# EAGLE design Callisto_v1p01 (EAGLE 9.6.2)
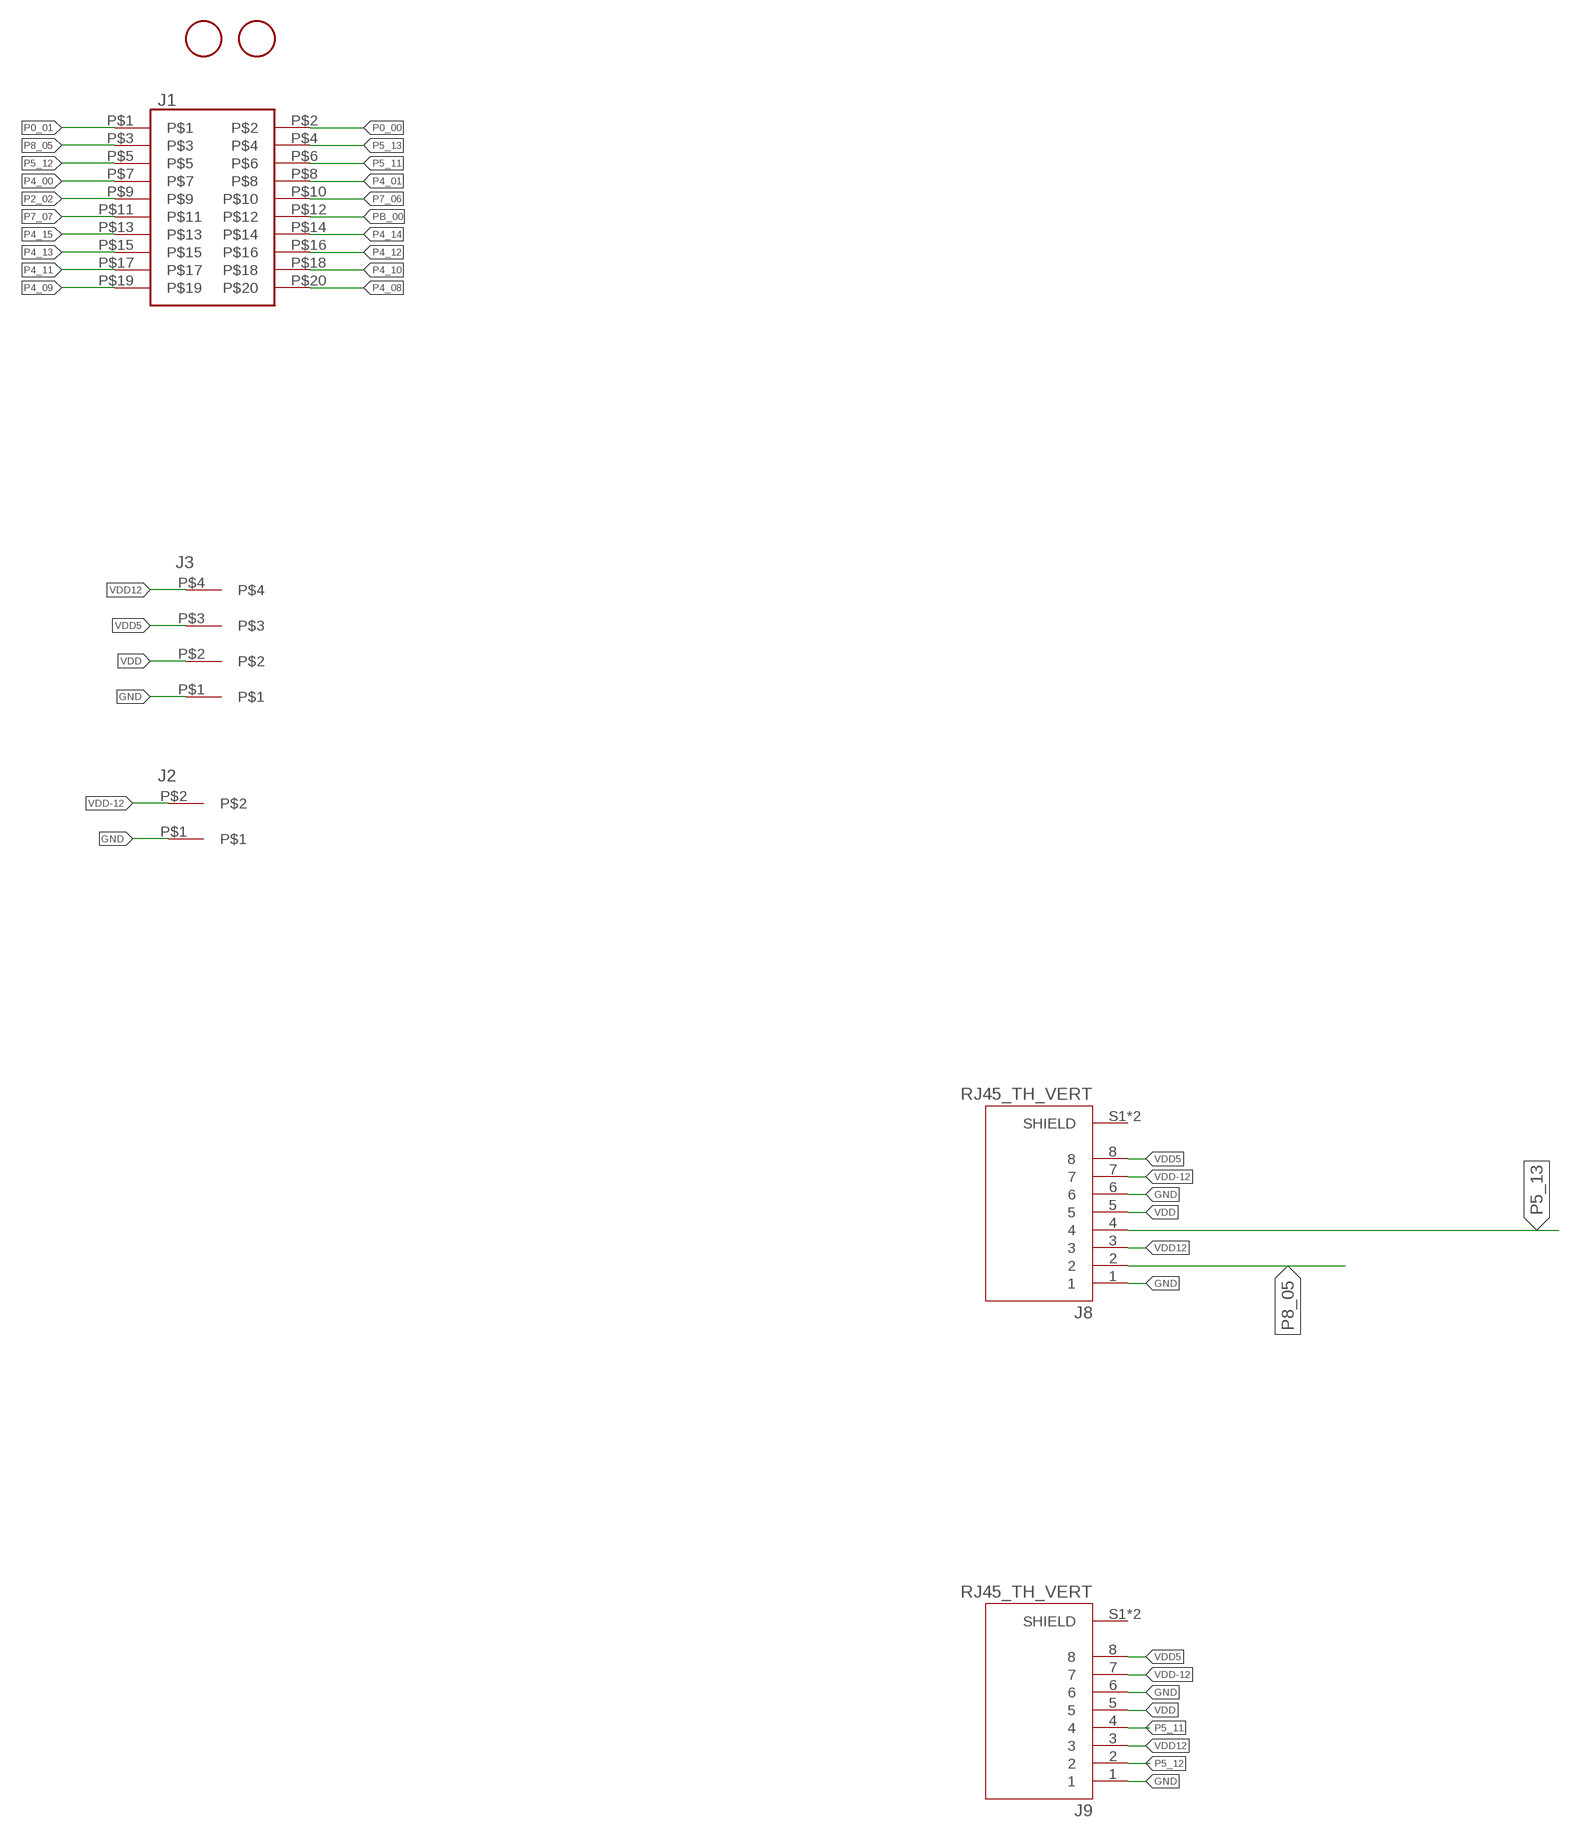
[diagram p0: schematic, sheet 1, part 1 of 2]
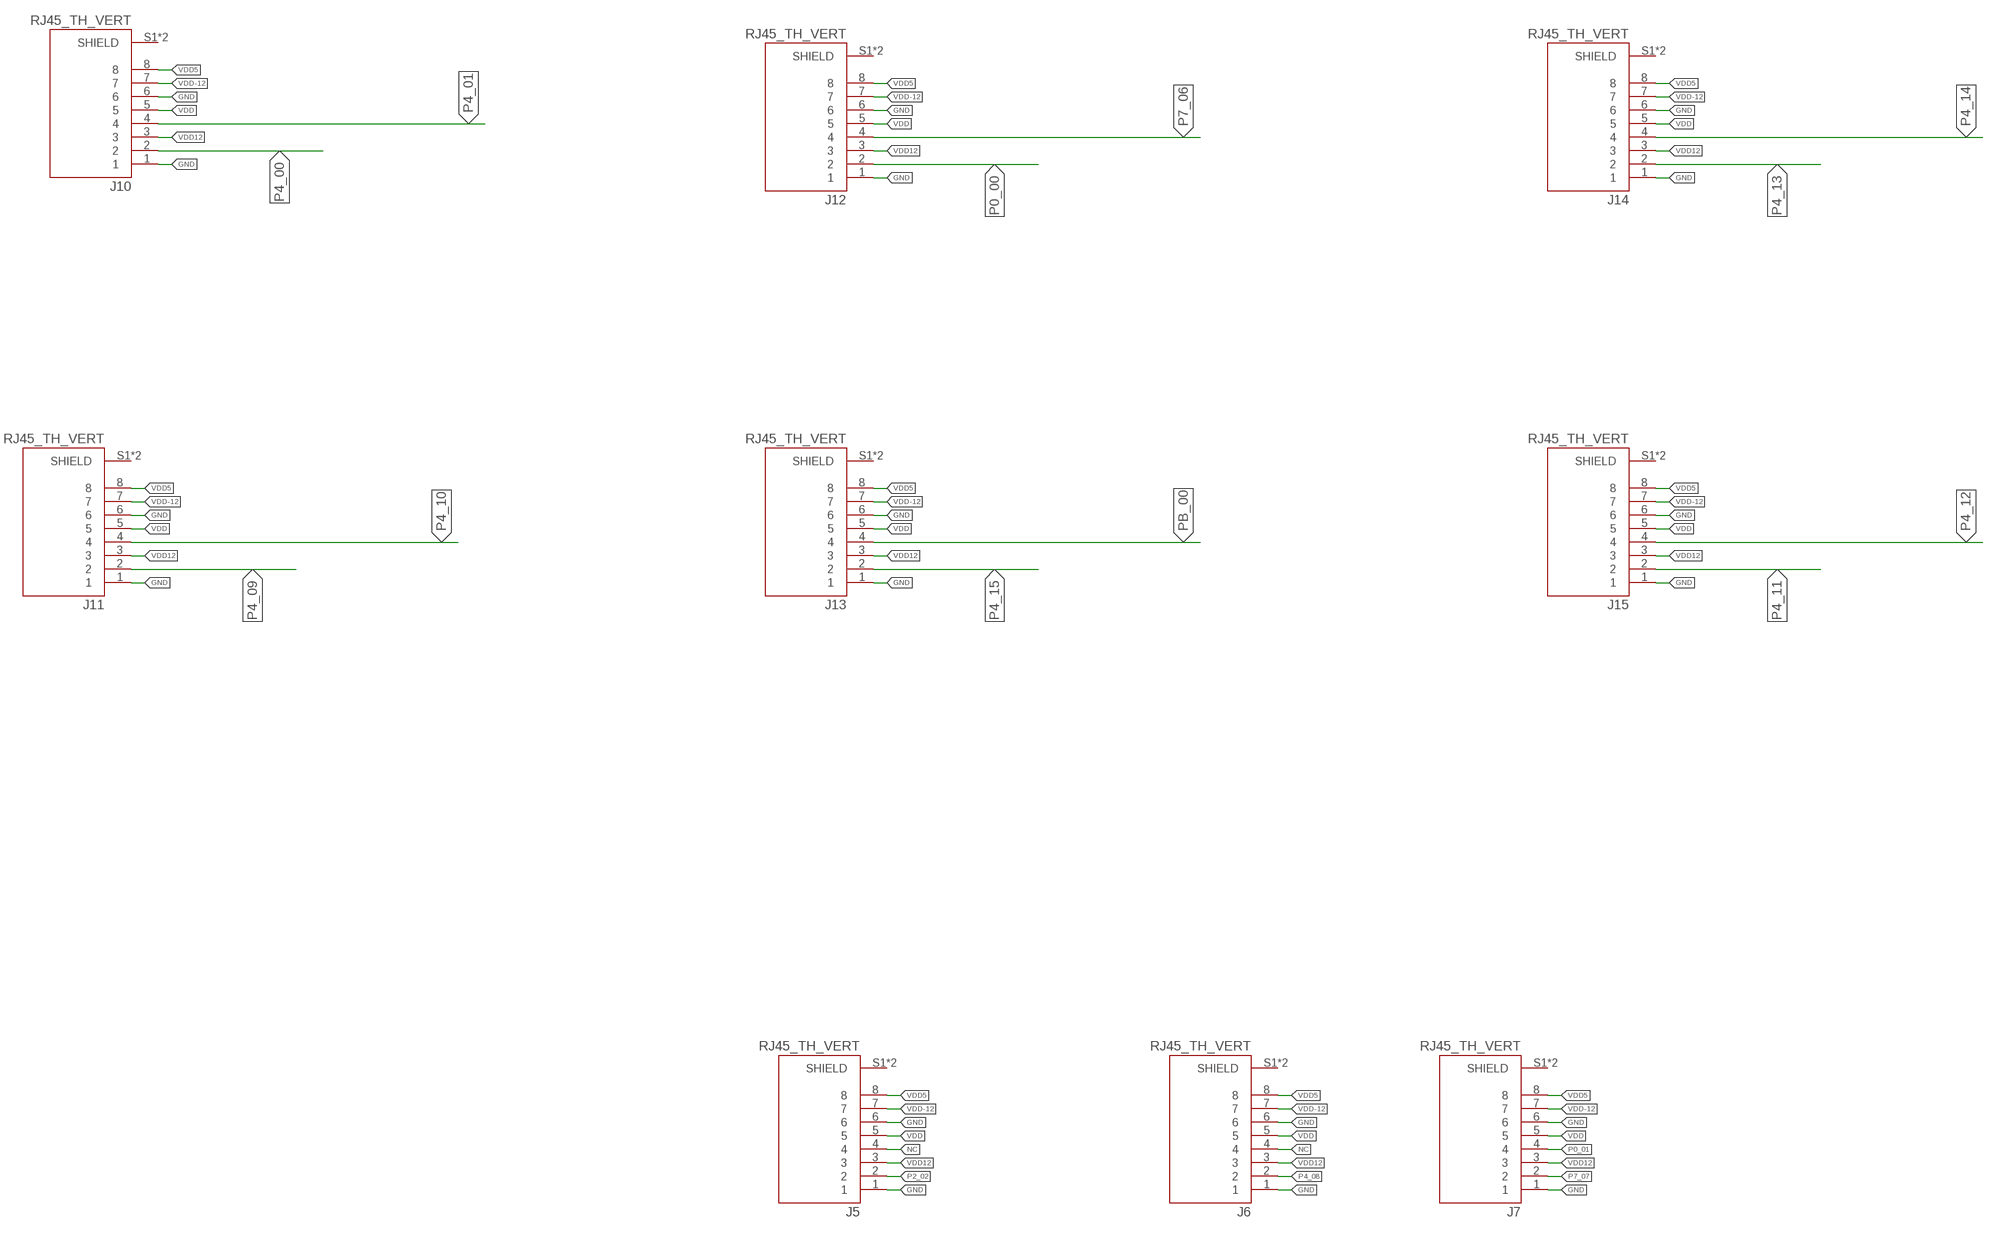
[diagram p1: schematic, sheet 1, part 2 of 2]

## Parts
J1  20-pos  2_X_10_HEADER_GENERIC  [2_X_10_.1_INCH]
J2  2-pos  3.81MM_1_X_2_RT_ANGLE_PLUG_HEADER  [2_3.81MM_PITCH]
J3  4-pos  3.81MM_1_X_4_RT_ANGLE_PLUG_HEADER  [1X4_3.81MM_PITCH]
J5  RJ45_TH_VERT  [ASSMANN_A-2014-2S-4-N-R]
J6  RJ45_TH_VERT  [ASSMANN_A-2014-2S-4-N-R]
J7  RJ45_TH_VERT  [ASSMANN_A-2014-2S-4-N-R]
J8  RJ45_TH_VERT  [ASSMANN_A-2014-2S-4-N-R]
J9  RJ45_TH_VERT  [ASSMANN_A-2014-2S-4-N-R]
J10  RJ45_TH_VERT  [ASSMANN_A-2014-2S-4-N-R]
J11  RJ45_TH_VERT  [ASSMANN_A-2014-2S-4-N-R]
J12  RJ45_TH_VERT  [ASSMANN_A-2014-2S-4-N-R]
J13  RJ45_TH_VERT  [ASSMANN_A-2014-2S-4-N-R]
J14  RJ45_TH_VERT  [ASSMANN_A-2014-2S-4-N-R]
J15  RJ45_TH_VERT  [ASSMANN_A-2014-2S-4-N-R]
U$1  FIDUCIAL_1MM  [FIDUCIAL_1MM]
U$2  FIDUCIAL_1MM  [FIDUCIAL_1MM]

## Nets
GND: J2.P$1 J3.P$1 J5.1 J5.6 J6.1 J6.6 J7.1 J7.6 J8.1 J8.6 J9.1 J9.6 J10.1 J10.6 J11.1 J11.6 J12.1 J12.6 J13.1 J13.6 J14.1 J14.6 J15.1 J15.6
NC: J5.4 J6.4
P0_00: J1.P$2 J12.2
P0_01: J1.P$1 J7.4
P2_02: J1.P$9 J5.2
P4_00: J1.P$7 J10.2
P4_01: J1.P$8 J10.4
P4_08: J1.P$20 J6.2
P4_09: J1.P$19 J11.2
P4_10: J1.P$18 J11.4
P4_11: J1.P$17 J15.2
P4_12: J1.P$16 J15.4
P4_13: J1.P$15 J14.2
P4_14: J1.P$14 J14.4
P4_15: J1.P$13 J13.2
P5_11: J1.P$6 J9.4
P5_12: J1.P$5 J9.2
P5_13: J1.P$4 J8.4
P7_06: J1.P$10 J12.4
P7_07: J1.P$11 J7.2
P8_05: J1.P$3 J8.2
PB_00: J1.P$12 J13.4
VDD: J3.P$2 J5.5 J6.5 J7.5 J8.5 J9.5 J10.5 J11.5 J12.5 J13.5 J14.5 J15.5
VDD5: J3.P$3 J5.8 J6.8 J7.8 J8.8 J9.8 J10.8 J11.8 J12.8 J13.8 J14.8 J15.8
VDD12: J3.P$4 J5.3 J6.3 J7.3 J8.3 J9.3 J10.3 J11.3 J12.3 J13.3 J14.3 J15.3
VDD-12: J2.P$2 J5.7 J6.7 J7.7 J8.7 J9.7 J10.7 J11.7 J12.7 J13.7 J14.7 J15.7
Unconnected: J5.S1(SHIELD) J5.S2(SHIELD) J6.S1(SHIELD) J6.S2(SHIELD) J7.S1(SHIELD) J7.S2(SHIELD) J8.S1(SHIELD) J8.S2(SHIELD) J9.S1(SHIELD) J9.S2(SHIELD) J10.S1(SHIELD) J10.S2(SHIELD) J11.S1(SHIELD) J11.S2(SHIELD) J12.S1(SHIELD) J12.S2(SHIELD) J13.S1(SHIELD) J13.S2(SHIELD) J14.S1(SHIELD) J14.S2(SHIELD) J15.S1(SHIELD) J15.S2(SHIELD)

## Library data of the parts
J1 = 3D_MIG_Controller:2_X_10_HEADER_GENERIC: CONN HEADER R/A 20POS 2.54MM, Straight, Right Angle; PARTNO: 67996-420HLF
J2 = 3D_MIG_Controller:3.81MM_1_X_2_RT_ANGLE_PLUG_HEADER: TERM BLOCK HDR 2POS 90DEG 3.81MM; PARTNO: 691322310002
J3 = 3D_MIG_Controller:3.81MM_1_X_4_RT_ANGLE_PLUG_HEADER: 4 Position Terminal Block Header, Male Pins, Shrouded (4 Side) 0.150" (3.81mm) 90°, Right Angle - Through Hole; PARTNO: 691322310004
J5-J15 = 3D_MIG_Controller:RJ45_TH_VERT: Jack Modular Connector 8p8c (RJ45, Ethernet) Vertical Shielded; DESCRIPTION: Jack Modular Connector 8p8c (RJ45, Ethernet) Vertical Shielded; DIGI-KEY_PART_NUMBER: AE10399-ND; MF: Assmann WSW Components; MP: A-2014-2S-4-N-R; PACKAGE: None
U$1 U$2 = 3D_MIG_Controller:FIDUCIAL_1MM: For use by pick and place machines to calibrate the vision/machine, 1mm By microbuilder.eu

## Board
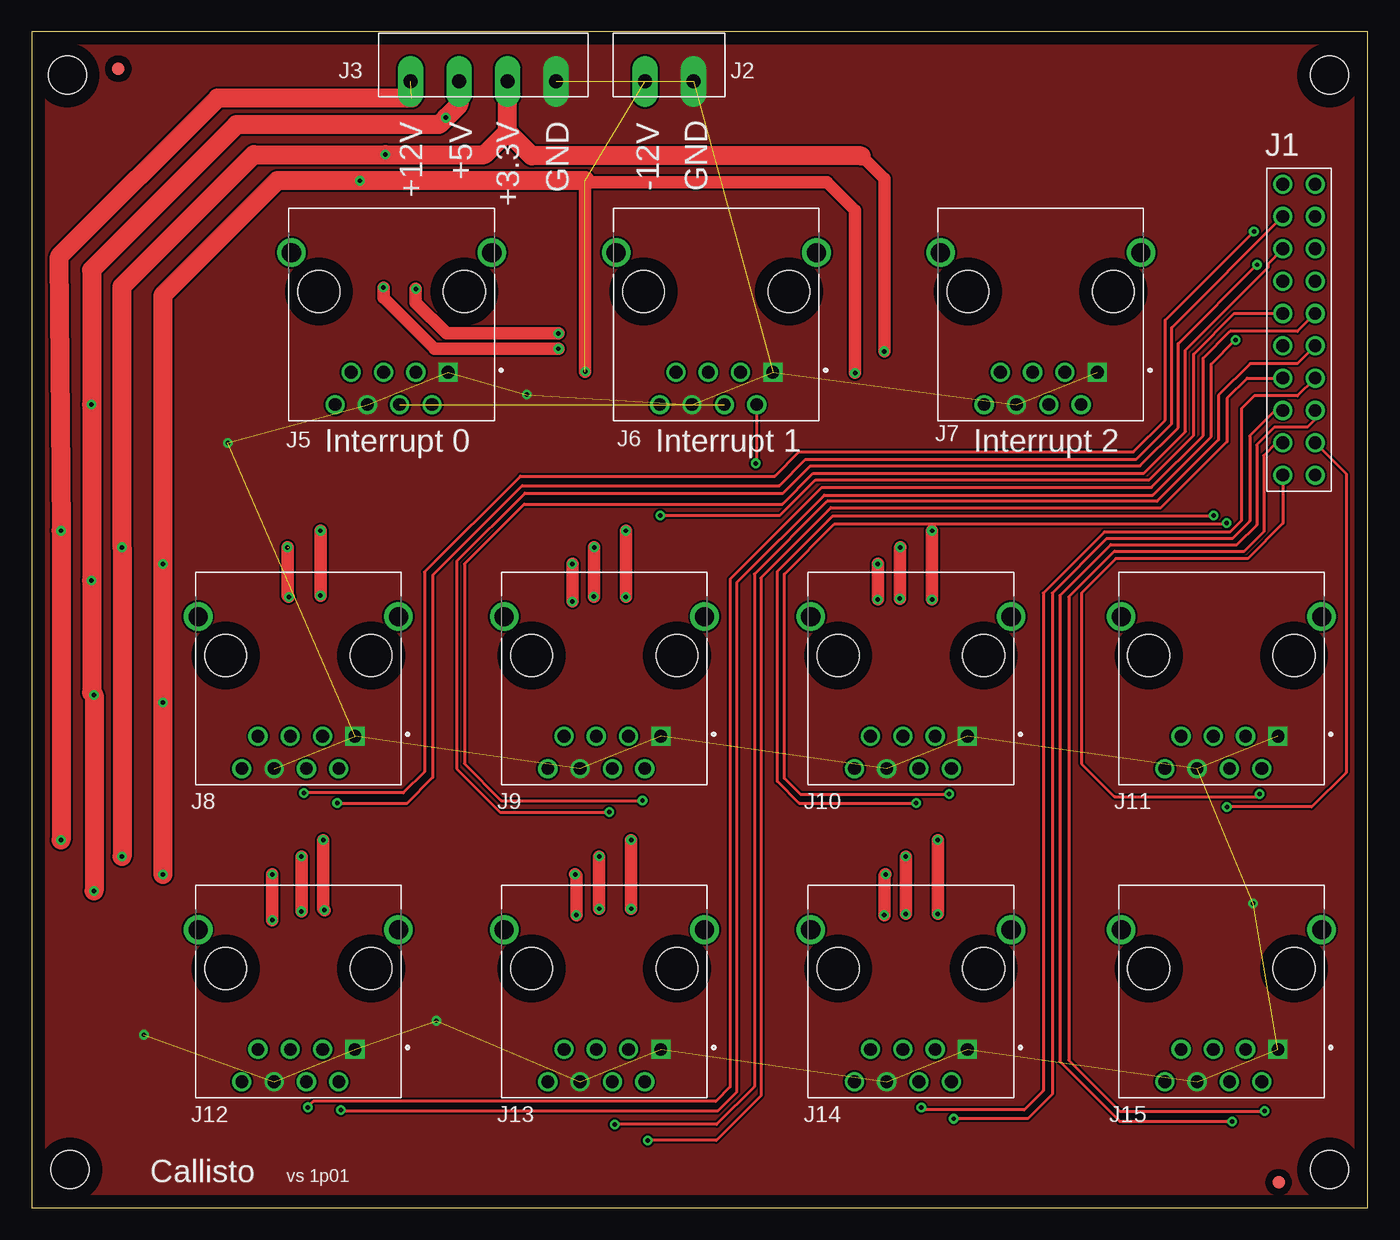
[diagram p2: board, top side]
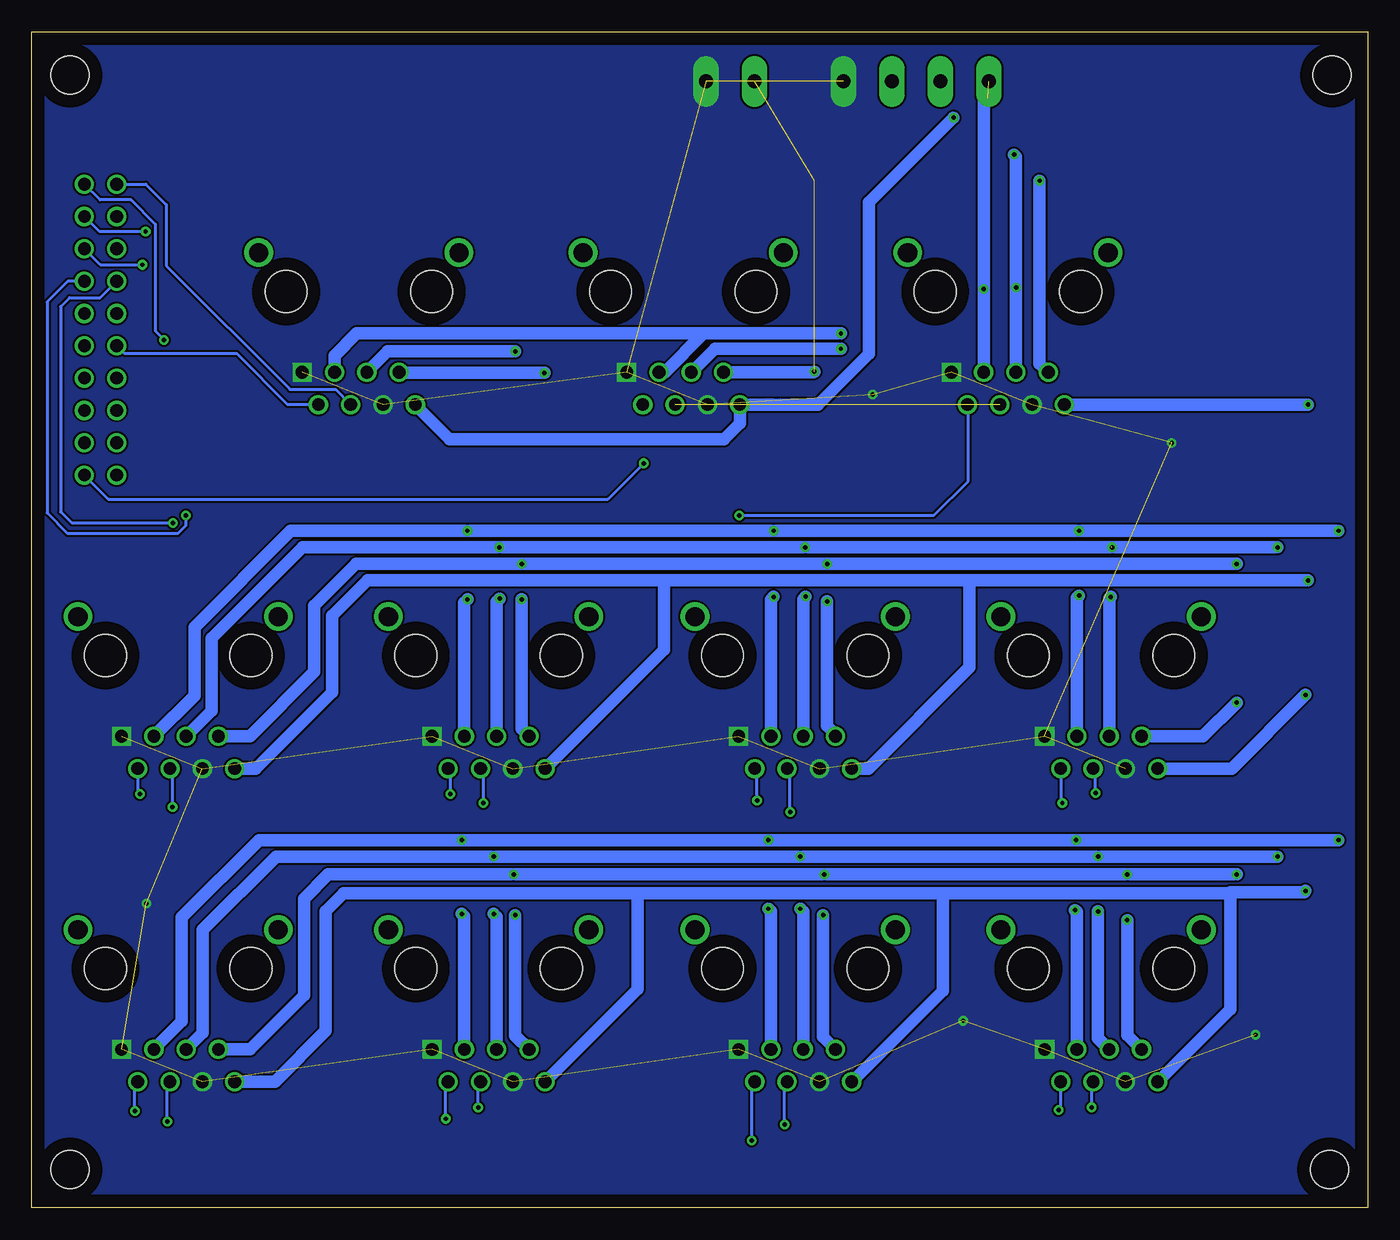
[diagram p3: board, bottom side, seen from below]

Size 105 x 92.4 mm. Coordinates in mm from the lower left corner, seen from the top.
Outline: 0,0 105,0 105,92.4 0,92.4 0,0
Copper layers (1*16): Top 0.035mm / dielectric 1.5mm / Bottom 0.035mm
Design rules "default": minimum track width 6mil, minimum drill 0.35mm, track to track 6mil, track to pad 6mil, pad to pad 6mil, via to via 6mil, smd to smd 6mil, copper to edge 40mil, drill to drill 6mil, minimum pad ring 10mil, minimum via ring 8mil, stop-mask expansion 4mil, vias tented up to drill 0mil, thermal gap 10mil
Holes 3 mm at 102,89 2.8,89 102,3 3,3

### Footprints (pad centres in the part's own frame; a part is rotated, then mirrored left to right if it is on the bottom)
2_X_10_.1_INCH = drill 1: P$1 -11.43,-1.27; P$2 -11.43,1.27; P$3 -8.89,-1.27; P$4 -8.89,1.27; P$5 -6.35,-1.27; P$6 -6.35,1.27; P$7 -3.81,-1.27; P$8 -3.81,1.27; P$9 -1.27,-1.27; P$10 -1.27,1.27; P$11 1.27,-1.27; P$12 1.27,1.27; P$13 3.81,-1.27; P$14 3.81,1.27; P$15 6.35,-1.27; P$16 6.35,1.27; P$17 8.89,-1.27; P$18 8.89,1.27; P$19 11.43,-1.27; P$20 11.43,1.27
2_3.81MM_PITCH = drill 1.1 pad 2 long: P$1 0,0; P$2 3.81,0
1X4_3.81MM_PITCH = drill 1.1 pad 2 long: P$1 0,0; P$2 3.81,0; P$3 7.62,0; P$4 11.43,0
ASSMANN_A-2014-2S-4-N-R = drill 1 square: 1 4.445,-6.35 | drill 1: 2 3.175,-8.89; 3 1.905,-6.35; 4 0.635,-8.89; 5 -0.635,-6.35; 6 -1.905,-8.89; 7 -3.175,-6.35; 8 -4.445,-8.89 | drill 1.5: S1 -7.875,3.05; S2 7.875,3.05 | hole 3.3: -5.715,0; 5.715,0
FIDUCIAL_1MM = smd 1 x 1: 1 0,0

### Placement (x,y rotation side)
J1  99.6,69 270 top
J2  52,88.5 180 top
J3  41.2,88.5 180 top
J5  28.28,72 0 top
J6  53.8,72 0 top
J7  79.3,72 0 top
J8  20.95,43.4 0 top
J9  45,43.4 0 top
J10  69.1,43.4 0 top
J11  93.5,43.4 0 top
J12  20.95,18.8 0 top
J13  45,18.8 0 top
J14  69.1,18.8 0 top
J15  93.5,18.8 0 top
U$1  6.8,89.5 0 top
U$2  98,2 0 top

### Tracks (layer width: path | path; a pad name or v marks a point on that pad's centre or on a via)
GND  (via drill 0.35)  (28 unrouted)
  other vias: 96,23.9 31.8,14.7 8.8,13.6 38.9,63.9 15.4,60.1
  pour Top (no thermals): 0,92.4 105,92.4 105,0 0,0
  pour Bottom (no thermals): 0,92.4 105,92.4 105,0 0,0
NC  (1 unrouted)
P0_00  (via drill 0.35)
  Top 0.254: v24.3,7.7 24.4,7.6 53.9,7.6 55.4,9.1 55.4,49.1 62.3,56 88.1,56 92.7,60.6 92.7,66.3 v94.6,68.2
  Bottom 0.254: v24.3,7.7 24.12,7.88 J12.2 | v94.6,68.2 95.3,68.9 95.3,77.3 97.2,79.2 99.64,79.2 J1.P$2
P0_01
  Bottom 0.254: J1.P$1 96.03,80.43 94.43,78.83 94.43,74.03 84.71,64.31 81.14,64.31 J7.4
P2_02  (via drill 0.35)
  Top 0.254: v49.4,54.4 58.8,54.4 61.6,57.2 87.83,57.2 91.33,60.7 91.33,67.07 94.53,70.27 J1.P$9
  Bottom 0.254: J5.2 31.4,63.05 31.4,57.1 34.1,54.4 v49.4,54.4
P4_00  (via drill 0.35)
  Top 0.254: v72.1,32.5 60.4,32.5 59.15,33.75 59.15,49.8 63.05,53.7 93.9,53.7 v93.9,53.8
  Bottom 0.254: v72.1,32.5 72.1,34.34 J10.2 | v93.9,53.8 101.84,53.8 102.73,54.69 102.73,70.81 102.03,71.51 99.63,71.51 J1.P$7
P4_01  (via drill 0.35)
  Top 0.254: v69.5,31.8 60.3,31.8 58.6,33.5 58.6,50 62.96,54.36 92.9,54.36 v92.9,54.4
  Bottom 0.254: v69.5,31.8 69.5,34.27 J10.4 | J1.P$8 102.17,72.81 103.8,71.18 103.8,54.6 102.2,53 93.5,53 92.9,53.6 v92.9,54.4
P4_08  (via drill 0.35)
  Top 0.254: J6.2 56.98,58.58 v56.9,58.5
  Bottom 0.254: v56.9,58.5 59.72,55.68 98.98,55.68 J1.P$20
P4_09  (via drill 0.35)
  Top 0.254: v96.5,32.5 96.3,32.3 85.1,32.3 82.5,34.9 82.5,48.3 85.2,51 95.56,51 98.33,53.77 J1.P$19
  Bottom 0.254: J11.2 96.67,32.67 v96.5,32.5
P4_10  (via drill 0.35)
  Top 0.254: v93.93,31.5 100.6,31.5 103.3,34.2 103.3,57.68 J1.P$18
  Bottom 0.254: v93.93,31.5 93.93,34.3 J11.4
P4_11  (via drill 0.35)
  Top 0.254: v96.9,7.6 85.5,7.6 81.5,11.6 81.5,48.01 85.09,51.6 95.32,51.6 96.83,53.11 96.83,59.11 97.83,60.11 J1.P$17
  Bottom 0.254: v96.9,7.6 96.9,9.69 J15.2
P4_12  (via drill 0.35)
  Top 0.254: v94.35,6.79 85.51,6.79 80.8,11.5 80.8,48.1 84.8,52.1 94.72,52.1 96.27,53.65 96.27,59.95 97.67,61.35 100.27,61.35 100.87,61.95 J1.P$16
  Bottom 0.254: v94.35,6.79 94.35,9.7 J15.4
P4_13  (via drill 0.35)
  Top 0.254: v72.47,7 78.3,7 80.21,8.91 80.21,48.3 84.51,52.6 94.38,52.6 95.73,53.95 95.73,60.65 97.73,62.65 J1.P$15
  Bottom 0.254: v72.47,7 72.47,9.71 J14.2
P4_14  (via drill 0.35)
  Top 0.254: v69.92,7.89 70.11,7.7 78,7.7 79.5,9.2 79.5,48.3 84.3,53.1 94.18,53.1 95.07,53.99 95.07,62.79 96.07,63.79 99.47,63.79 J1.P$14
  Bottom 0.254: v69.92,7.89 69.94,7.91 69.94,9.61
  Bottom 0.406: J14.4 69.73,9.81 69.94,9.61
P4_15  (via drill 0.35)
  Top 0.254: v48.4,5.3 53.8,5.3 57.3,8.8 57.3,49.5 62.81,55.01 88.75,55.01 93.93,60.19 93.93,63.59 95.53,65.19 J1.P$13
  Bottom 0.254: v48.4,5.3 48.4,9.69 J13.2
P5_11  (via drill 0.35)
  Top 0.254: v96.3,74.1 90.1,67.9 90.1,61.3 87.1,58.3 61.2,58.3 59.05,56.15 38.75,56.15 33.4,50.8 33.4,34.5 36.8,31.1 v45.4,31.1
  Bottom 0.254: v45.4,31.1 45.4,34.27 J9.4 | v96.3,74.1 99.62,74.1 J1.P$6
P5_12  (via drill 0.35)
  Top 0.254: v48,32 36.9,32 34,34.9 34,50.6 38.7,55.3 59,55.3 61.4,57.7 87.4,57.7 90.68,60.98 90.68,67.4 97.13,73.85 97.13,74.15 J1.P$5
  Bottom 0.254: v48,32 48,34.34 J9.2
P5_13  (via drill 0.35)
  Top 0.254: v21.4,32.6 29.2,32.6 30.86,34.26 30.86,49.96 38.4,57.5 58.4,57.5 60.3,59.4 86.6,59.4 89.09,61.89 89.09,69.75 v96.05,76.71
  Bottom 0.254: J1.P$4 99.7,76.72 v96.06,76.72 v96.05,76.71 | v21.4,32.6 21.4,34.33 J8.4
P7_06  (via drill 0.35)
  Top 0.254: v21.7,7.9 21.7,7.93 22.13,8.36 53.76,8.36 54.89,9.49 54.89,49.39 62.1,56.6 88,56.6 92.07,60.67 92.07,66.77 94.17,68.87 99.47,68.87 J1.P$10
  Bottom 0.254: v21.7,7.9 21.7,9.79 J12.4
P7_07
  Bottom 0.254: J1.P$11 97.73,67.13 88.89,67.13 84.88,63.11 J7.2
P8_05  (via drill 0.35)
  Top 0.254: J1.P$3 89.6,69.16 89.6,61.6 86.8,58.8 60.8,58.8 58.75,56.75 38.55,56.75 31.52,49.72 31.52,33.81 29.5,31.8 v24,31.8
  Bottom 0.254: J8.2 24.12,31.93 v24,31.8
PB_00  (via drill 0.35)
  Top 0.254: v45.83,6.56 53.84,6.56 56.8,9.53 56.8,49.8 62.5,55.5 88.44,55.5 93.27,60.33 93.27,63.83 95.77,66.33 99.47,66.33 J1.P$12
  Bottom 0.254: v45.83,6.56 45.83,9.71 J13.4
VDD  (via drill 0.35)  (1 unrouted)
  Top 1: v44.18,48.02 44.18,51.88 v44.2,51.9 | v68.23,47.87 68.23,51.83 v68.27,51.9 | v20.2,48 20.1,48.1 v20.1,51.9 | v68.7,23.1 v68.7,27.6 | v21.2,23.3 v21.2,27.6 | v44.6,23.5 v44.6,27.6 | v41.4,67.5 31.64,67.5 27.64,71.5 v27.64,72.3 | v67,67.3 67,80.85 65.2,82.65
  Top 1.5: v7.1,27.6 v7.1,51.9 7.1,72.4 17.45,82.75 v27.8,82.75 35.58,82.75 37.39,84.55 | 37.39,84.55 J3.P$2 | 37.39,84.55 39.29,82.65 65.2,82.65
  Bottom 1: J15.5 91.56,13.76 91.56,21.86 85.81,27.6 v68.7,27.6 v44.6,27.6 v21.2,27.6 v7.1,27.6 | J11.5 90.86,39.06 90.86,44.76 83.71,51.9 v68.27,51.9 v44.2,51.9 20.2,51.9 | v20.1,51.9 v7.1,51.9 | v44.18,48.02 44.37,47.84 J9.5 | J10.5 68.47,47.63 v68.23,47.87 | v20.2,48 20.32,47.88 J8.5 | J14.5 68.47,22.86 v68.7,23.1 | J12.5 21.2,13.34 v21.2,23.3 | J13.5 44.37,23.27 v44.6,23.5 | J5.5 v27.64,72.3 27.64,82.59 v27.8,82.75 | J6.5 51.31,67.5 v41.4,67.5 | J7.5 77.02,67.3 v67,67.3
VDD5  (via drill 0.35)
  Top 0.508: J3.P$3 33.58,90.14
  Top 1.5: v4.9,24.9 v4.9,40.3 4.7,40.5 v4.7,49.3 v4.7,63.11 4.7,73.7 16.1,85.1 32,85.1 v32.55,85.65 33.58,86.68 J3.P$3
  Bottom 1: 10.8,24.7 33.4,24.7 | 33.4,24.7 57.4,24.7 | 57.4,24.7 80.5,24.7 81.9,23.3 81.9,13.9 85.89,9.91 J15.8 | J14.8 57.4,17.16 57.4,24.7 | J13.8 33.4,17.07 33.4,24.7 | J12.8 10.8,15.62 10.8,24.7 | 10.8,24.7 10.8,24.8 5,24.8 v4.9,24.9 | J10.8 55.3,43.87 55.3,49.3 | J11.8 87.41,34.51 81.4,40.52 81.4,46.52 78.61,49.3 55.3,49.3 | v4.7,49.3 31.3,49.3 | 31.3,49.3 55.3,49.3 | J9.8 39.26,34.51 31.3,42.47 31.3,49.3 | J8.8 10.69,34.51 v4.9,40.3 | J5.8 v4.7,63.11 | v32.55,85.65 39.2,79 39.2,67.1 43.19,63.11 J6.8 49.35,61.65 50.6,60.4 72.14,60.4 J7.8
VDD12  (via drill 0.35)  (1 unrouted)
  Top 1: v46.7,48 v46.7,53.2 | v70.75,47.81 v70.75,53.2 | v22.7,48.1 v22.7,53.2 | v71.2,23.1 v71.2,28.9 | v23,23.4 22.9,23.5 v22.9,28.9 | v47.1,23.5 v47.1,28.9 | v41.4,68.7 32.59,68.7 30.18,71.1 v30.18,72.2
  Top 1.5: v2.3,28.9 v2.3,53.2 2.33,53.3 2.17,74.77 14.6,87.2 29.87,87.2
  Bottom 1: J15.3 93.21,14.65 93.21,22.81 87.12,28.9 v71.2,28.9 v47.1,28.9 v22.9,28.9 v2.3,28.9 | J11.3 92.21,40.25 92.21,45.63 84.64,53.2 v70.75,53.2 v46.7,53.2 v22.7,53.2 v2.3,53.2 | J9.3 46.91,47.8 v46.7,48 | J10.3 71,47.55 v70.75,47.81 | J8.3 22.86,47.95 v22.7,48.1 | v71.2,23.1 71,22.91 J14.3 | v23,23.4 22.86,23.25 J12.3 | v47.1,23.5 46.91,23.3 J13.3 | J5.3 v30.18,72.2 30.18,88.08 J3.P$4 | J6.3 55.25,65.65 52.2,68.7 | 52.2,68.7 v41.4,68.7 | 52.2,68.7 79.45,68.7 81.2,66.95 J7.3
VDD-12  (via drill 0.35)  (2 unrouted)
  Top 1: v42.49,50.6 v42.49,47.64 | v66.5,47.8 v66.5,50.6 | v18.9,22.6 v18.9,26.2 | v42.8,23 42.8,26.1 v42.7,26.2 | v67,23 67,26.1 v67.1,26.2 | v43.5,65.7 43.5,80.59 62.5,80.59 64.7,78.39 v64.7,65.6
  Top 1.5: 43.5,80.7 v25.8,80.7 19.3,80.7 10.3,71.7 v10.3,50.6 v10.3,39.7 v10.3,26.2
  Bottom 1: J8.7 12.95,37.05 v10.3,39.7 | J11.7 87.86,37.05 82.8,42.11 82.8,47.3 79.5,50.6 v66.5,50.6 v42.49,50.6 v10.3,50.6 | J9.7 41.83,37.21 42.49,37.88 v42.49,47.64 | J10.7 66.5,37.62 v66.5,47.8 | J15.7 87.85,12.45 83.6,16.7 83.6,24.3 81.7,26.2 v67.1,26.2 v42.7,26.2 v18.9,26.2 v10.3,26.2 | J12.7 18.9,13.57 v18.9,22.6 | J13.7 42.8,13.43 v42.8,23 | J14.7 67,13.53 v67,23 | J6.7 43.55,65.65 v43.5,65.7 | J5.7 25.14,65.65 25.8,66.31 v25.8,80.7 | J7.7 76.08,65.6 v64.7,65.6

### Text on the board
tPlace: Interrupt 0 | Interrupt 1 | Interrupt 2 | Callisto | vs 1p01
tNames: +5V | GND | -12V | GND | +12V | +3.3V